# EAGLE design pixee (EAGLE 9.3.0)

## Sheet 1 of 2
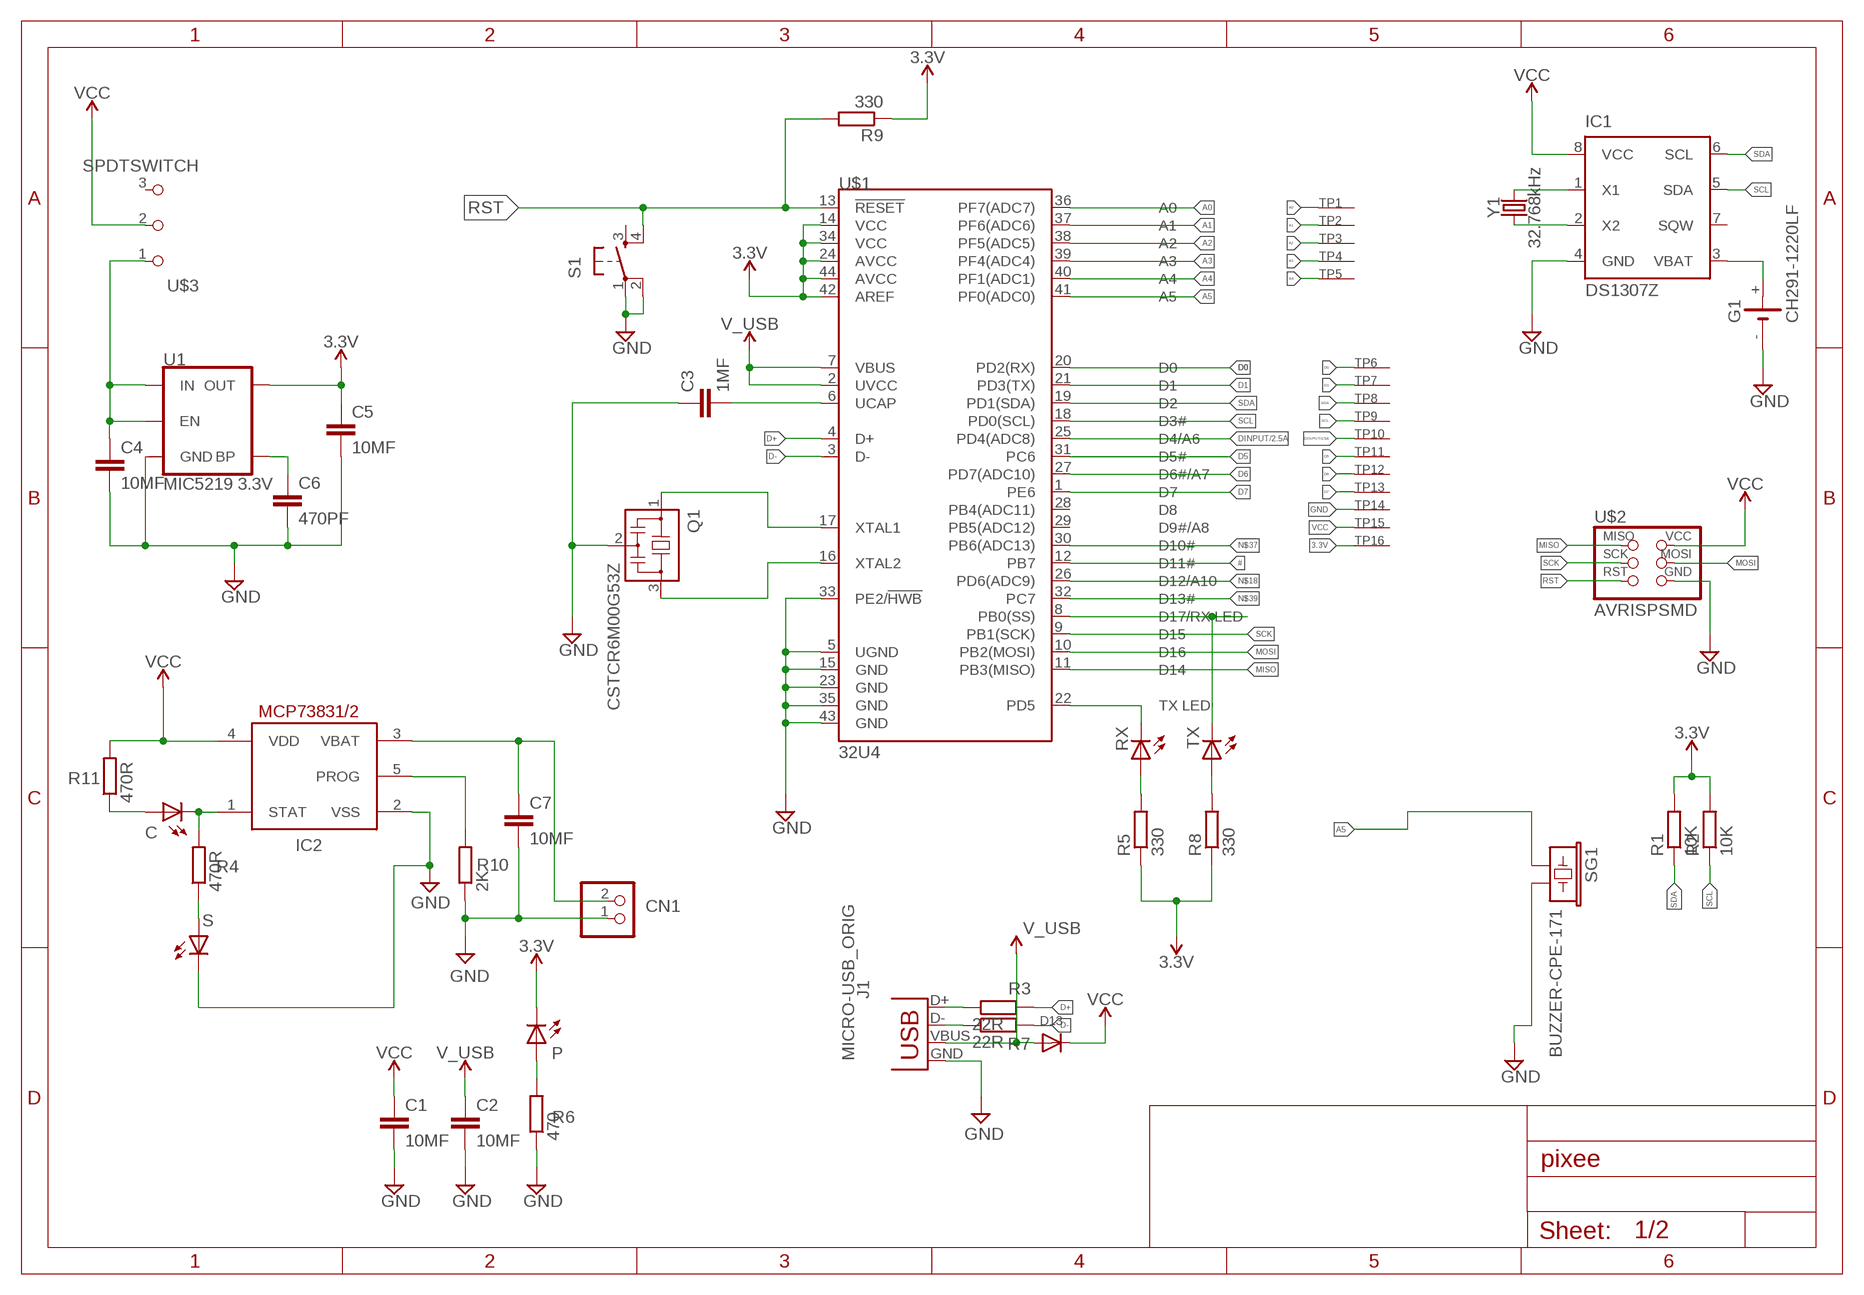
[diagram p0: schematic, sheet 1]

### Parts
C  LEDCHIP-LED0805  [CHIP-LED0805]
C1  10MF  C-EUC0603  [C0603]
C2  10MF  C-EUC0603  [C0603]
C3  1MF  C-EUC0603  [C0603]
C4  10MF  C-EUC0603  [C0603]
C5  10MF  C-EUC0603  [C0603]
C6  470PF  C-EUC0603  [C0603]
C7  10MF  C-EUC0603  [C0603]
CN1  JST_2PIN-SMT  [JST-PH-2-SMT]
D13  DIODESOD-123  [SOD-123]
G1  CH291-1220LF  [CH291-1220LF]
IC1  DS1307Z  [SOIC8]
IC2  MCP73831/OT  [SOT23-5L]
J1  MICRO-USB_ORIG  [DX4R005HJ5]
P  LEDCHIP-LED0805  [CHIP-LED0805]
Q1  CSTCR6M00G53Z  [CSTCR6M]
R1  10K  R-EU_M0805  [M0805]
R2  10K  R-EU_M0805  [M0805]
R3  22R  R-EU_M0805  [M0805]
R4  470R  R-EU_M0805  [M0805]
R5  330  R-EU_M0805  [M0805]
R6  470  R-EU_M0805  [M0805]
R7  22R  R-EU_M0805  [M0805]
R8  330  R-EU_M0805  [M0805]
R9  330  R-EU_M0805  [M0805]
R10  2K  R-EU_M0805  [M0805]
R11  470R  R-EU_M0805  [M0805]
RX  LEDCHIP-LED0805  [CHIP-LED0805]
S  LEDCHIP-LED0805  [CHIP-LED0805]
S1  6MM_SWITCH6MM_SWITCH  [6MM_SWITCH]
SG1  BUZZER-CPE-171  [BUZZER_9MM_PTH]
TP1  SEWTAP-2.0IN  [SEWINGTAP_2.0]
TP2  SEWTAP-2.0IN  [SEWINGTAP_2.0]
TP3  SEWTAP-2.0IN  [SEWINGTAP_2.0]
TP4  SEWTAP-2.0IN  [SEWINGTAP_2.0]
TP5  SEWTAP-2.0IN  [SEWINGTAP_2.0]
TP6  SEWTAP-2.0IN  [SEWINGTAP_2.0]
TP7  SEWTAP-2.0IN  [SEWINGTAP_2.0]
TP8  SEWTAP-2.0IN  [SEWINGTAP_2.0]
TP9  SEWTAP-2.0IN  [SEWINGTAP_2.0]
TP10  SEWTAP-2.0IN  [SEWINGTAP_2.0]
TP11  SEWTAP-2.0IN  [SEWINGTAP_2.0]
TP12  SEWTAP-2.0IN  [SEWINGTAP_2.0]
TP13  SEWTAP-2.0IN  [SEWINGTAP_2.0]
TP14  SEWTAP-2.0IN  [SEWINGTAP_2.0]
TP15  SEWTAP-2.0IN  [SEWINGTAP_2.0]
TP16  SEWTAP-2.0IN  [SEWINGTAP_2.0]
TX  LEDCHIP-LED0805  [CHIP-LED0805]
U1  MIC5219 3.3V  V_REG_MIC52193.3V  [SOT23-5]
U$1  32U4  ATMEGA32U4TQFP-44  [TQFP44]
U$2  AVRISPSMD  [2X03SMD]
U$3  SPDTSWITCH  [SPDTSWITCH]
Y1  32.768kHz  CRYSTAL-32.768KHZPTH-2X6  [CRYSTAL-PTH-2X6-CYL]

### Nets
3.3V: C5.1 P.C R1.2 R2.2 R5.1 R8.1 R9.1 TP16.P$1(SEW) U1.5(OUT) U$1.14(VCC) U$1.24(AVCC) U$1.34(VCC) U$1.42(AREF) U$1.44(AVCC)
#: U$1.12(PB7)
A0: TP1.P$1(SEW) U$1.36(PF7(ADC7))
A1: TP2.P$1(SEW) U$1.37(PF6(ADC6))
A2: TP3.P$1(SEW) U$1.38(PF5(ADC5))
A3: TP4.P$1(SEW) U$1.39(PF4(ADC4))
A4: TP5.P$1(SEW) U$1.40(PF1(ADC1))
A5: SG1.P$1 U$1.41(PF0(ADC0))
D0: TP6.P$1(SEW) U$1.20(PD2(RX))
D1: TP7.P$1(SEW) U$1.21(PD3(TX))
D5: TP11.P$1(SEW) U$1.31(PC6)
D6: TP12.P$1(SEW) U$1.27(PD7(ADC10))
D7: TP13.P$1(SEW) U$1.1(PE6)
D+: R3.2 U$1.4(D+)
D-: R7.2 U$1.3(D-)
DINPUT: TP10.P$1(SEW) U$1.25(PD4(ADC8)) ; also sheet 2
GND: C1.2 C2.2 C3.1 C4.2 C5.2 C6.2 C7.2 CN1.1 G1.- IC1.4(GND) IC2.2(VSS) J1.GND Q1.2 R6.1 R10.1 S1.1(P) S1.2(P1) S.C SG1.P$2 TP14.P$1(SEW) U1.2(GND) U$1.5(UGND) U$1.15(GND) U$1.23(GND) U$1.33(PE2/!HWB) U$1.35(GND) U$1.43(GND) U$2.6(GND) ; also sheet 2
MISO: U$1.11(PB3(MISO)) U$2.1(MISO)
MOSI: U$1.10(PB2(MOSI)) U$2.4(MOSI)
N$12: C3.2 U$1.6(UCAP)
N$13: Q1.1 U$1.17(XTAL1)
N$14: Q1.3 U$1.16(XTAL2)
N$15: IC1.1(X1) Y1.2
N$16: IC1.2(X2) Y1.1
N$17: G1.+ IC1.3(VBAT)
N$18: U$1.26(PD6(ADC9))
N$19: C.C IC2.1(STAT) R4.2
N$20: IC2.5(PROG) R10.2
N$21: P.A R6.2
N$22: C.A R11.1
N$23: R4.1 S.A
N$24: C7.1 CN1.2 IC2.3(VBAT)
N$25: J1.D+ R3.1
N$26: C6.1 U1.4(BP)
N$27: J1.D- R7.1
N$28: C4.1 U1.1(IN) U1.3(EN) U$3.1
N$29: RX.C U$1.22(PD5)
N$30: R5.2 RX.A
N$32: R8.2 TX.A
N$37: U$1.30(PB6(ADC13))
N$39: U$1.32(PC7)
N$40: TX.C U$1.8(PB0(SS))
RST: R9.2 S1.4(S1) U$1.13(!RESET) U$2.5(RST)
SCK: U$1.9(PB1(SCK)) U$2.3(SCK)
SCL: IC1.5(SDA) R2.1 TP9.P$1(SEW) U$1.18(PD0(SCL))
SDA: IC1.6(SCL) R1.1 TP8.P$1(SEW) U$1.19(PD1(SDA))
V_USB: C2.1 D13.A J1.VBUS U$1.2(UVCC) U$1.7(VBUS)
VCC: C1.1 D13.C IC1.8(VCC) IC2.4(VDD) R11.2 TP15.P$1(SEW) U$2.2(VCC) U$3.2 ; also sheet 2
Unconnected: IC1.7(SQW) S1.3(S) U$1.28(PB4(ADC11)) U$1.29(PB5(ADC12)) U$3.3

## Sheet 2 of 2
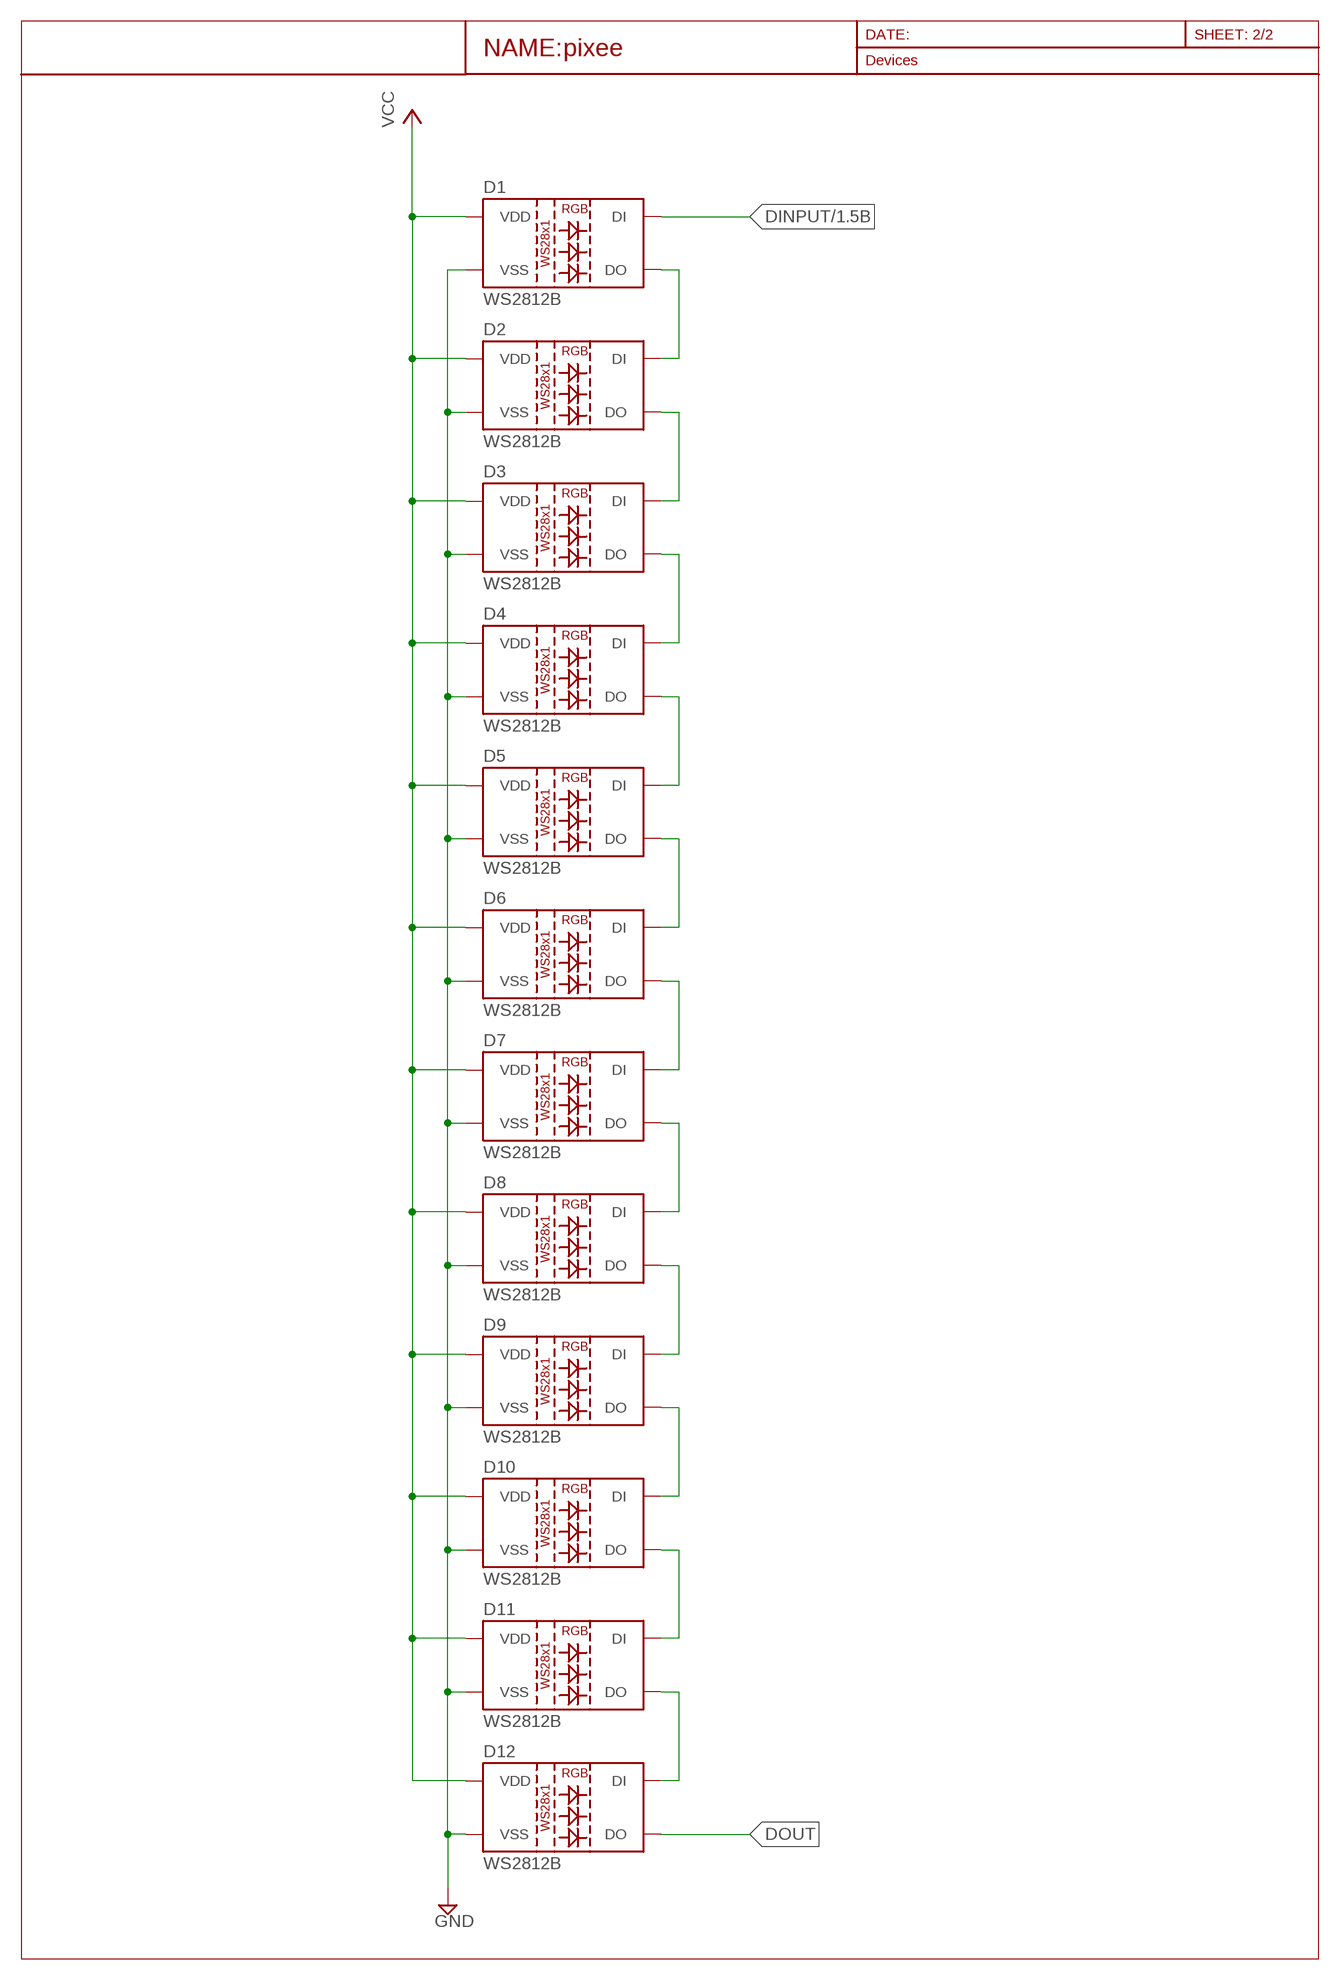
[diagram p1: schematic, sheet 2]

### Parts
D1  WS2812B  [WS2812B]
D2  WS2812B  [WS2812B]
D3  WS2812B  [WS2812B]
D4  WS2812B  [WS2812B]
D5  WS2812B  [WS2812B]
D6  WS2812B  [WS2812B]
D7  WS2812B  [WS2812B]
D8  WS2812B  [WS2812B]
D9  WS2812B  [WS2812B]
D10  WS2812B  [WS2812B]
D11  WS2812B  [WS2812B]
D12  WS2812B  [WS2812B]

### Nets
DINPUT: D1.4(DI) ; also sheet 1
DOUT: D12.2(DO)
GND: D1.3(VSS) D2.3(VSS) D3.3(VSS) D4.3(VSS) D5.3(VSS) D6.3(VSS) D7.3(VSS) D8.3(VSS) D9.3(VSS) D10.3(VSS) D11.3(VSS) D12.3(VSS) ; also sheet 1
N$1: D1.2(DO) D2.4(DI)
N$2: D2.2(DO) D3.4(DI)
N$3: D3.2(DO) D4.4(DI)
N$4: D4.2(DO) D5.4(DI)
N$5: D5.2(DO) D6.4(DI)
N$6: D6.2(DO) D7.4(DI)
N$7: D7.2(DO) D8.4(DI)
N$8: D8.2(DO) D9.4(DI)
N$9: D9.2(DO) D10.4(DI)
N$10: D10.2(DO) D11.4(DI)
N$11: D11.2(DO) D12.4(DI)
VCC: D1.1(VDD) D2.1(VDD) D3.1(VDD) D4.1(VDD) D5.1(VDD) D6.1(VDD) D7.1(VDD) D8.1(VDD) D9.1(VDD) D10.1(VDD) D11.1(VDD) D12.1(VDD) ; also sheet 1

## Library data of the parts
C P RX S TX = adafruit:LED: LED OSRAM: - CHIPLED LG R971, LG N971, LY N971, LG Q971, LY Q971, LO R971, LY R971 LH N974, LH R974 LS Q976, LO Q976, LY Q976 LO Q996 - Hyper CHIPLED LW Q18S LB Q993, LB Q99A, LB R99A - SideLED LS A670, LO A670, LY A670, LG A670, LP A670 LB A673, LV A673, LT A673, LW A673 LH A674 LY A675 LS A676, LA A676, LO A676, LY A676, LW A676 LS A679, LY A679, LG A679 - Hyper Micro SIDELED® LS Y876, LA Y876, LO Y876, LY Y876 LT Y87S - SmartLED LW L88C, LW L88S LB L89C, LB L89S, LG L890 LS L89K, LO L89K, LY L89K LS L896, LA L896, LO L896, LY L896 - TOPLED LS T670, LO T670, LY T670, LG T670, LP T670 LSG T670, LSP T670, LSY T670, LOP T670, LYG T670 LG T671, LOG T671, LSG T671 LB T673, LV T673, LT T673, LW T673 LH T674 LS T676, LA T676, LO T676, LY T676, LB T676, LH T676, LSB T676, LW T676 LB T67C, LV T67C, LT T67C, LS T67K, LO T67K, LY T67K, LW E67C LS E67B, LA E67B, LO E67B, LY E67B, LB E67C, LV E67C, LT E67C LW T67C LS T679, LY T679, LG T679 LS T770, LO T770, LY T770, LG T770, LP T770 LB T773, LV T773, LT T773, LW T773 LH T774 LS E675, LA E675, LY E675, LS T675 LS T776, LA T776, LO T776, LY T776, LB T776 LHGB T686 LT T68C, LB T68C - Hyper Mini TOPLED® LB M676 - Mini TOPLED Santana® LG M470 LS M47K, LO M47K, LY M47K Source: http://www.osram.convergy.de/
C1-C7 = rcl:C-EU: CAPACITOR, European symbol; SPICEPREFIX: C
CN1 = adafruit:JST_2PIN: JST 2-Pin Connectors of various flavors SMT-RA (S2B-PH-SM4) 4UConnector #17311 SMT (B2B-PH-SM4) THM-RA (S2B-PH) THM (B2B-PH)
D1-D12 = SparkFun-LED:WS2812B: WS2812B SMD addressable RGB LED 5x5mm SMD LED with built-in controller IC. Color: Red/Green/Blue mC Rating: RGB: 390, 660, 180 mcd Forward Voltage: RGB: 2.0, 3.0, 3.0 V Packages:WS2812B SparkFun Products: Blynk Board - ESP8266 <https://www.sparkfun.com/products/13794>; PROD_ID: DIO-12503
D13 = adafruit:DIODE: Diode SMADIODE - SMA Surface Mount Package 20V 1A Schottky Diode Digikey: 641-1014-6-ND DO-1N4148 - Through Hole Small Current Diode SOD-123 20V 1 A (.5mV Vf) Schottky Diode - Digikey: MBRX120TPMSCT-ND SOD-323 10V 570mA (.38mV Vf, 3ns) Schottky Diode - Digikey: ZLLS410CT-ND SOD-523 30V 30mA Schottky Diode (RB751S-40TE61) - Digikey: RB751S-40TE61CT-ND SOT23-R/W - SOT23 Package (R = Solder Paste/Reflow Ovens, W = Hand-Soldering) BAT54Film 40V 300mA - Digikey: 497-7162-1-ND
G1 = battery:CH291-1220LF: Battery Holder, SMT, 12mm multicomp PART NO. CH291-1220LF Source: Data sheet <http://www.farnell.com/datasheets/1505860.pdf>
IC1 = ds1307_pcf8583:DS1307: I2C-Bus CLOCK/CALENDAR
IC2 = adafruit:MCP73831: MCP73831/2 Miniature Single-Cell, Fully Integrated Li-Ion, Li-Polymer Charge Management Controllers. Nice and small simple lipoly charge controller, with adjustable current and status output (LED) http://www.ladyada.net/library/pcb/eaglelibrary.html
J1 = fab:MICRO-USB: SMD micro USB connector as found in the fablab inventory. Three footprint variants included: original, as described by manufacturer's datasheet for milling with the 1/100" bit for milling with the 1/64" bit Made by Zaerc.
Q1 = murata-filter:CSTCR: Resonator Source: murata.co.jp; MPN: CSTCR6M00G53-R0; OC_FARNELL: 1170434; OC_NEWARK: 25M8759
R1-R11 = rcl:R-EU_: RESISTOR, European symbol; SPICEPREFIX: R
S1 = fab:6MM_SWITCH: OMRON SWITCH
SG1 = bt_buzzer:BUZZER: Buzzer 12mm Spark Fun Electronics SKU : Comp-Buzzer
TP1-TP16 = adafruit:SEWTAP
U1 = SparkFun-IC-Power:V_REG_MIC5219: V_REG MIC5219 Standard 3.3V and 5V 500mA LDO voltage regulator in SOT-23 layout. Micrel part MIC5219. BP (by-pass) pin is used to lower output noise with 470pF cap, may be left open.; PROD_ID: VREG-09872
U$1 = SparkFun-IC-Microcontroller:ATMEGA32U4: Atmel MCU, 32KByte Atmel 44-pin 8-bit Microcontroller with 32KBytes of ISP Flash and USB Controller Datasheet <http://cdn.sparkfun.com/datasheets/Dev/Arduino/Boards/ATMega32U4.pdf> SparkFun Products LilyPad Arduino USB - ATmega32U4 Board <https://www.sparkfun.com/products/12049> (DEV-12049) Pro Micro - 5V/16MHz <https://www.sparkfun.com/products/12640> (DEV-12640) Pro Micro - 3.3V/8MHz <https://www.sparkfun.com/products/12587> (DEV-12587) Fio v3 - ATmega32U4 <https://www.sparkfun.com/products/11520> (DEV-11520) Qduino Mini <https://www.sparkfun.com/products/13614> (DEV-13614) Makey Makey - Standard Kit <https://www.sparkfun.com/products/11511> (WIG-11511) Makey Makey Deluxe Kit <https://www.sparkfun.com/products/11519> (WIG-11519); PROD_ID: IC-11161
U$2 = fab:AVRISP
U$3 = fab:SPDTSWITCH
Y1 = SparkFun-Clocks:CRYSTAL-32.768KHZ: 32.768kHz Crystal Frequency: 32.768kHz Frequency Stability: ±20ppm Load Capacitance: 12.5pF (PTH-2X6 & SMD-3.2X1.5), 6pF (SMD-2X6) SparkFun Products: SparkFun BigTime Watch Kit <https://www.sparkfun.com/products/11734> SparkFun nRF52832 Breakout <https://www.sparkfun.com/products/13990> SparkFun Real Time Clock Module <https://www.sparkfun.com/products/12708>; PROD_ID: XTAL-10112

## Board
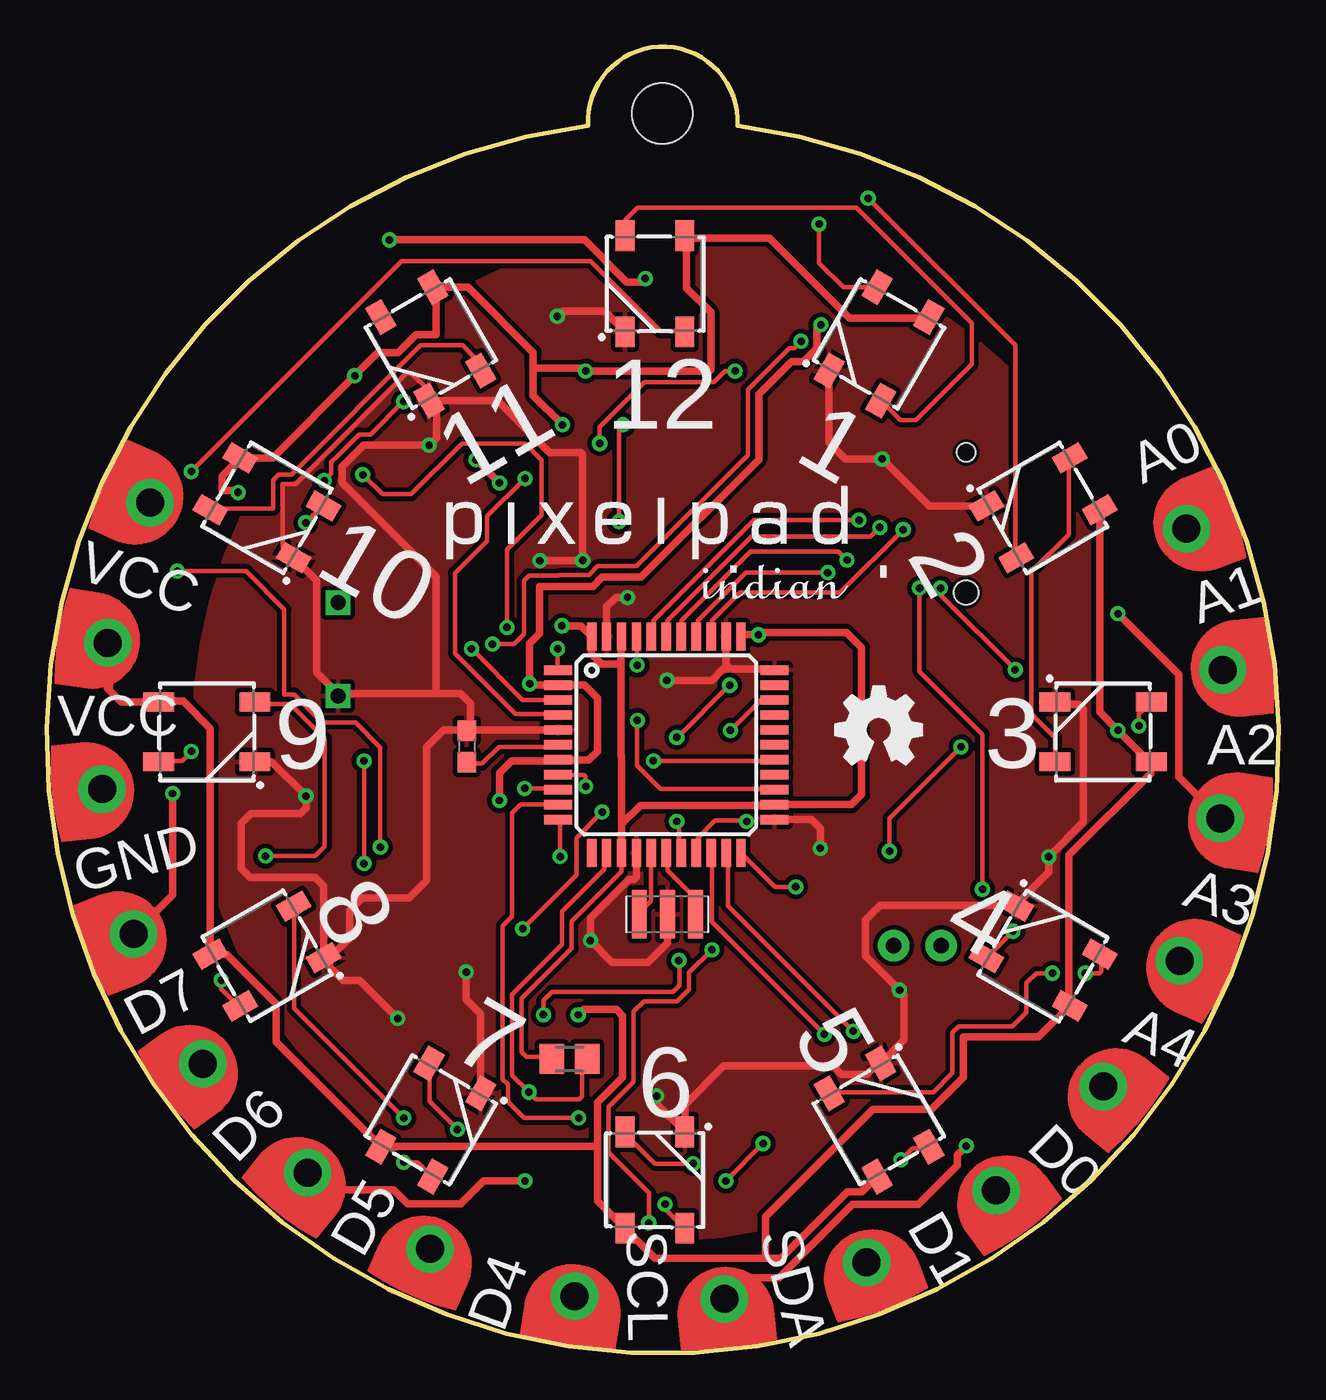
[diagram p2: board, top side]
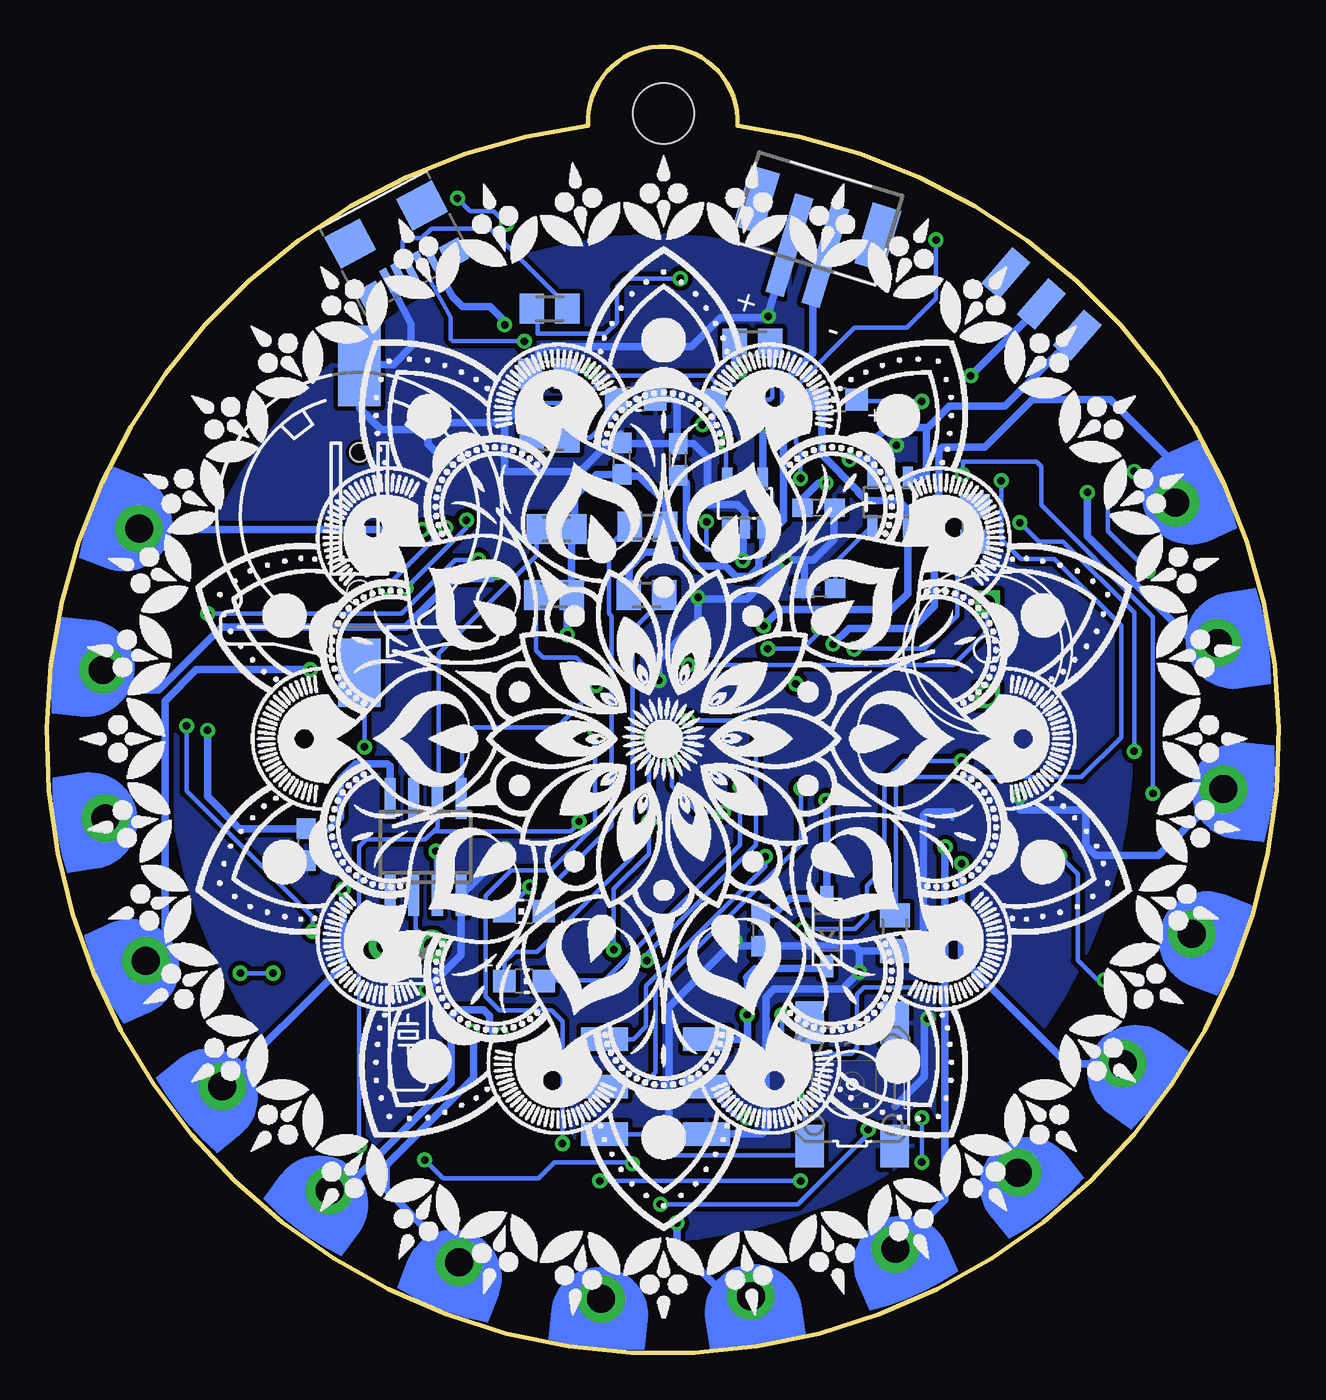
[diagram p3: board, bottom side, seen from below]

Size 65.99 x 69.95 mm. Coordinates in mm from the lower left corner, seen from the top.
Outline: 29,65.71 arc346 36.99,65.71 arc187 29,65.71
Copper layers (1*16): Top 0.035mm / dielectric 1.5mm / Bottom 0.035mm
Design rules "default *": minimum track width 10mil, minimum drill 0.4mm, track to track 10mil, track to pad 10mil, pad to pad 10mil, via to via 10mil, smd to smd 10mil, copper to edge 8mil, drill to drill 8mil, minimum pad ring 10mil, minimum via ring 8mil, stop-mask expansion 4mil, vias tented up to drill 0mil, thermal gap 10mil
Holes 3.25 mm at 32.96,66.36

### Footprints (pad centres in the part's own frame; a part is rotated, then mirrored left to right if it is on the bottom)
CHIP-LED0805 = smd 1.2 x 1.2: A 0,-1.05; C 0,1.05
C0603 = smd 1.1 x 1: 1 -0.85,0; 2 0.85,0
JST-PH-2-SMT = smd 1 x 5.5: 1 -1,-1.8; 2 1,-1.8 | smd 1.6 x 3.4: NC1 -3.4,0; NC2 3.4,0
WS2812B = smd 1.651 x 1: 1 2.577,-1.6; 2 2.577,1.6; 3 -2.577,1.6; 4 -2.577,-1.6
SOD-123 = smd 1.2 x 0.7: A 1.85,0; C -1.85,0
CH291-1220LF = smd 2.3 x 3.66: + 0,-2.296 | smd 2.3 x 4.3: - 0,14.146 | hole 1.3: 0,2 | hole 1: 0,9.5
SOIC8 = smd 0.6 x 2.2: 1 -1.905,-2.6; 2 -0.635,-2.6; 3 0.635,-2.6; 4 1.905,-2.6; 5 1.905,2.6; 6 0.635,2.6; 7 -0.635,2.6; 8 -1.905,2.6
SOT23-5L = smd 0.55 x 1.2: 1 -0.95,-1.3; 2 0,-1.3; 3 0.95,-1.3; 4 0.95,1.3; 5 -0.95,1.3
DX4R005HJ5 = smd 0.4 x 1.35: D+ 0,1.6; D- -0.65,1.6; GND 1.3,1.6; ID 0.65,1.6; VBUS -1.3,1.6 | smd 1.2 x 1.3: GND@1 -2.5,1.95; GND@2 2.5,1.95 | smd 2.15 x 1.9: GND@3 -2.175,-1.1; GND@4 2.175,-1.1
CSTCR6M = smd 0.8 x 2.6: 1 -1.5,0; 2 0,0; 3 1.5,0
M0805 = smd 1.3 x 1.6: 1 -0.95,0; 2 0.95,0
6MM_SWITCH = smd 2.286 x 1.524: 1 -3.302,2.286; 2 3.302,2.286; 3 -3.302,-2.286; 4 3.302,-2.286
BUZZER_9MM_PTH = drill 0.8 square: P$1 0,2.5; P$2 0,-2.5
SEWINGTAP_2.0 = drill 1.5 pad 2.54: P$1 0,0
SOT23-5 = smd 0.55 x 1.2: 1 -0.95,-1.3; 2 0,-1.3; 3 0.95,-1.3; 4 0.95,1.3; 5 -0.95,1.3
TQFP44 = smd 1.5 x 0.5: 1 -5.8,4; 2 -5.8,3.2; 3 -5.8,2.4; 4 -5.8,1.6; 5 -5.8,0.8; 6 -5.8,0; 7 -5.8,-0.8; 8 -5.8,-1.6; 9 -5.8,-2.4; 10 -5.8,-3.2; 11 -5.8,-4; 23 5.8,-4; 24 5.8,-3.2; 25 5.8,-2.4; 26 5.8,-1.6; 27 5.8,-0.8; 28 5.8,0; 29 5.8,0.8; 30 5.8,1.6; 31 5.8,2.4; 32 5.8,3.2; 33 5.8,4 | smd 0.5 x 1.5: 12 -4,-5.8; 13 -3.2,-5.8; 14 -2.4,-5.8; 15 -1.6,-5.8; 16 -0.8,-5.8; 17 0,-5.8; 18 0.8,-5.8; 19 1.6,-5.8; 20 2.4,-5.8; 21 3.2,-5.8; 22 4,-5.8; 34 4,5.8; 35 3.2,5.8; 36 2.4,5.8; 37 1.6,5.8; 38 0.8,5.8; 39 0,5.8; 40 -0.8,5.8; 41 -1.6,5.8; 42 -2.4,5.8; 43 -3.2,5.8; 44 -4,5.8
2X03SMD = smd 2.54 x 1.27: 1 -2.54,2.54; 2 2.92,2.54; 3 -2.54,0; 4 2.92,0; 5 -2.54,-2.54; 6 2.92,-2.54
SPDTSWITCH = smd 2.54 x 1.27: 1 0.38,2.54; 2 0.38,0; 3 0.38,-2.54
CRYSTAL-PTH-2X6-CYL = drill 0.813 pad 1.676: 1 -1.27,0; 2 1.27,0

### Placement (x,y rotation side)
C  29.16,51.05 90 bottom
C1  52.09,27.21 270 bottom
C2  27.75,22.64 270 bottom
C3  22.5,32.47 270 top
C4  24.65,45.26 0 bottom
C5  35.18,47.89 90 bottom
C6  24.6,40.93 180 bottom
C7  32.17,47.84 90 bottom
CN1  24.72,60.75 343 bottom
D1  32.58,57.25 90 top
D2  44.58,54.04 60 top
D3  53.36,45.25 30 top
D4  56.58,33.25 0 top
D5  53.36,21.25 330 top
D6  44.58,12.47 300 top
D7  32.58,9.25 270 top
D8  20.58,12.47 240 top
D9  11.79,21.25 210 top
D10  8.58,33.25 180 top
D11  11.79,45.25 150 top
D12  20.58,54.04 120 top
D13  24.19,22.54 90 bottom
G1  49.24,38.72 0 bottom
IC1  45.7,27.09 0 bottom
IC2  28.59,45.5 0 bottom
J1  47.29,59.45 208 bottom
P  23.67,51.05 90 bottom
Q1  33.24,23.49 180 top
R1  38.68,44.11 0 bottom
R2  38.82,40.57 0 bottom
R3  39.06,55.92 180 bottom
R4  39.06,49.01 180 bottom
R5  33.81,44.24 180 bottom
R6  20.57,22.47 90 bottom
R7  16.26,44.4 270 bottom
R8  33.87,40.57 0 bottom
R9  28,15.73 0 top
R10  39.15,52.44 0 bottom
R11  28.19,54.06 180 bottom
RX  40.42,23.64 90 bottom
S  34.45,51.07 270 bottom
S1  22.85,14.37 270 bottom
SG1  15.6,37.68 0 bottom
TP1  61.04,44.13 291 top
TP2  62.99,36.58 276 top
TP3  62.84,28.63 261 top
TP4  60.68,21 246 top
TP5  56.59,14.26 231 top
TP6  50.85,8.7 216 top
TP7  43.9,4.84 201 top
TP8  36.29,2.89 186 top
TP9  28.28,3.04 171 top
TP10  20.54,5.56 156 top
TP11  13.98,9.65 141 top
TP12  8.36,15.48 126 top
TP13  4.66,22.43 111 top
TP14  2.97,30.19 96 top
TP15  3.28,38.02 81 top
TP16  5.53,45.53 66 top
TX  40.42,19.91 270 bottom
U1  20.82,45.56 180 bottom
U$1  33.19,32.56 0 top
U$2  33.57,14.26 0 bottom
U$3  12.46,56.46 229 bottom
Y1  46.63,21.8 180 bottom

### Tracks (layer width: path | path; a pad name or v marks a point on that pad's centre or on a via)
3.3V  (via drill 0.4)
  Top 0.254: 30.75,26.83 U$1.14 30.79,25.79 28.12,23.12 28.12,21.66 25.44,18.98 25.44,16.12 25.7,15.85 26.93,15.85 R9.1 | 30.75,38.33 U$1.42 30.75,38.46 | 29.25,38.46 U$1.44 | 38.87,29.33 U$1.24 | U$1.34 37.25,38.46 | 5.62,45.46 TP16.P$1 5.75,45.21
  Top 0.406: 39.03,29.31 37.85,29.31 37.85,29.32 31.79,29.32 30.79,28.31 | 39.5,29.31 39.03,29.31 | 39.03,29.31 U$1.24 43.1,29.36 43.64,29.89 43.64,37.77 42.83,38.58 38.24,38.58 v38.12,38.46 37.25,38.46 | U$1.14 30.79,28.31 | 30.79,28.31 30.79,31.95 30.76,31.98 30.76,36.75 | 30.75,38.33 30.76,38.32 30.76,36.75 | 30.76,36.75 30.63,36.88 29.72,36.88 29.19,37.42 U$1.44 | U$1.44 | U$1.44 28.61,38.94 v27.6,38.94
  Bottom 0.254: 20,44.33 U1.5 | P.C | 38.12,40.33 38,40.46 R2.2 37.75,40.58 | 37.75,44.08 R1.2 37.62,44.21 | 32.75,44.33 R5.1 32.62,44.21 | 34.75,40.58 R8.1 | 35.12,46.71 35.12,46.96 C5.1 35.12,46.71
  Bottom 0.406: P.C 24.48,50.82 24.48,48.1 22.5,46.12 22.5,46.07 22.07,45.64 20.37,45.64 19.94,45.21 19.88,45.21 | 19.88,45.21 U1.5 19.87,40.68 20.74,39.81 26.73,39.81 v27.6,38.94 | R8.1 34.82,42.03 33.96,42.89 32.92,42.89 32.92,44.03 32.86,44.08 R5.1 32.86,45.56 34.26,46.96 35.12,46.96 | C5.1 36.54,47.04 37.73,45.85 37.73,44.51 | 37.73,44.51 R1.2 | R2.2 37.87,44.38 37.73,44.51 | 38.12,40.33 v38.12,38.46 | TP16.P$1 5.53,47.56 9.02,51.04 13.2,51.04 15.74,48.5 18.03,48.5 18.21,48.32 18.21,45.86 18.87,45.21 19.88,45.21
A0  (via drill 0.4)
  Top 0.254: v45.87,44.08 42.5,40.71 37.12,40.71 35.62,39.21 35.62,38.46 U$1.36
  Bottom 0.254: 61,44.08 TP1.P$1
  Bottom 0.406: v45.87,44.08 61.57,44.08 61.62,44.13 | 61.68,44.2 61.62,44.13 | 61.62,44.13 TP1.P$1
A1  (via drill 0.4)
  Top 0.254: v41.83,41.78 37.44,41.78 34.87,39.21 34.87,38.46 U$1.37
  Bottom 0.254: 62.87,36.58 62.97,36.58 TP2.P$1 62.05,37.51
  Bottom 0.406: 62.97,36.58 61.9,35.5 60,35.5 56.63,38.87 46.77,38.87 44.16,41.47 42.14,41.47 v41.83,41.78
A2  (via drill 0.4)
  Top 0.254: U$1.38 34,38.46 34,39.21 37.71,42.92 42.41,42.92 v42.87,42.46 | 62.75,28.71 TP3.P$1
  Top 0.406: TP3.P$1 60.63,30.84 60.63,36.32 v57.37,39.58
  Bottom 0.254: v42.87,42.46 44.12,42.46 47,39.58 v57.37,39.58
A3  (via drill 0.4)
  Top 0.254: v44.62,44.21 44.12,43.71 37.75,43.71 33.25,39.21 33.25,38.46 U$1.39 | v47.87,40.96 47.87,40.58 v51.87,36.58
  Bottom 0.254: v47.87,40.96 v44.62,44.21 | TP4.P$1 60.62,21.08 60.3,21.08
  Bottom 0.406: TP4.P$1 59.66,22.02 59.66,34.91 57.99,36.58 v51.87,36.58
A4  (via drill 0.4)
  Top 0.254: v43.51,44.59 37.88,44.59 32.5,39.21 32.5,38.46 U$1.40 | v46.75,40.96 46.75,36.5 50.12,33.12 v50.12,24.83
  Bottom 0.254: 56.5,14.33 TP5.P$1 | v46.75,40.96 43.51,44.19 v43.51,44.59
  Bottom 0.406: v50.12,24.83 50.12,20.73 TP5.P$1
A5  (via drill 0.4)
  Top 0.254: v31.62,36.83 31.62,38.33 U$1.41
  Bottom 0.254: v31.62,36.83 17.42,36.83 15.6,38.65 SG1.P$1
D0  (via drill 0.4)
  Top 0.254: v41.64,17.06 35.62,23.09 35.62,26.71 U$1.20
  Bottom 0.254: 50.5,8.71 50.75,8.71 TP6.P$1
  Bottom 0.406: TP6.P$1 50.09,8.69 44.33,14.45 44.33,18.02 43.99,18.36 42.58,18.36 42.28,18.06 42.28,17.37 41.97,17.06 v41.64,17.06
D1  (via drill 0.4)
  Top 0.254: v43.2,17.22 36.5,23.92 36.5,26.71 U$1.21
  Bottom 0.254: TP7.P$1 44,4.96
  Bottom 0.406: TP7.P$1 47.82,8.75 47.82,10.03 43.13,14.72 43.13,17.16 v43.2,17.22
D5  (via drill 0.4)
  Top 0.254: v36.62,33.33 38.25,34.96 38.87,34.96 U$1.31 | v36.37,9.21 v38.37,11.21 | TP11.P$1 14,9.58
  Top 0.406: TP11.P$1 14.89,8.74 18.57,8.74 19.32,7.98 22.17,7.98 23.39,9.21 v25.62,9.21
  Bottom 0.254: v36.62,33.33 36.62,28.21 39,25.83 41.12,25.83 42.5,24.46 42.5,19.1 41.73,18.34 38.96,18.34 38.37,17.75 v38.37,11.21 | v25.62,9.21 v36.37,9.21
D6  (via drill 0.4)
  Top 0.254: v32.5,31.71 38.87,31.71 U$1.27 | v29.75,28.96 28.37,27.58 28.37,25.58 v25.5,22.71 | v17,26.21 v17,31.71
  Bottom 0.254: 8.37,15.58 TP12.P$1 | v17,31.71 20.07,31.71 21.12,30.66 21.12,25.96 22.07,25.01 22.07,23.35 22.71,22.71 v25.5,22.71 | v29.75,28.96 31.1,28.96 32.5,30.35 v32.5,31.71
  Bottom 0.406: v17,26.21 17,21.15 11.33,15.48 TP12.P$1
D7  (via drill 0.4)
  Top 0.254: v27.37,37.71 27.37,36.58 U$1.1 | v16.93,47.03 17.98,45.98 19.52,45.98 22.25,48.71 25.62,48.71 26.51,47.82 26.51,44.88 24.65,43.02 v24.65,38.85 | 4.75,22.46 TP13.P$1
  Top 0.406: TP13.P$1 6.75,24.52 v6.75,29.96
  Bottom 0.254: v6.75,29.96 6.75,39.42 12.72,45.39 12.72,47.47 12.98,47.73 16.93,47.73 v16.93,47.03 | v27.37,37.71 25.49,37.71 24.65,38.55 v24.65,38.85
D+  (via drill 0.4)
  Top 0.254: U$1.4 27.37,34.21 25.12,34.21 21.87,37.46 21.87,41.77 23.59,43.49 23.59,44.8 v25.62,46.83
  Top 0.406: v18.37,59.6 28.8,59.6 31.07,57.34 31.86,57.34 v32.06,57.54
  Bottom 0.254: 40.12,55.83 R3.2 39.7,55.61 39.7,54.58 36.05,54.58 35.45,55.18 35.45,57.1 35.02,57.54 v32.06,57.54 | v25.62,46.83 25.62,48.49 25.86,48.73 25.86,51.76 22.72,54.9 19.92,54.9 18.37,56.45 v18.37,59.6
D-  (via drill 0.4)
  Top 0.254: v22.75,37.71 25.5,34.96 27.37,34.96 U$1.3
  Bottom 0.254: v22.75,37.71 18.98,37.71 17.21,39.48 17.21,41.88 17,42.09 16.51,42.09 16.37,42.23 16.37,43.33 R7.2 16.26,42.82
DINPUT  (via drill 0.4)
  Top 0.254: U$1.25 38.87,30.21 32.87,30.21 31.62,31.46 31.62,33.85 v31.64,33.87 | v7.75,47.21 19,58.46 29.12,58.46 32.87,54.71 34.12,54.71 D1.4 | v7,41.86 10.67,41.86 12.72,39.81 12.72,35.26 13.25,35.26 14.76,33.75 16.55,33.75 17.87,32.43 v17.87,27.08 | v33.86,21.01 33.89,20.98 33.89,19.69 33.54,19.33 27.07,19.33 26.6,18.87 v26.6,18.11
  Bottom 0.254: v33.86,21.01 33.86,21.34 28,27.21 28,33.48 28.39,33.87 v31.64,33.87 | TP10.P$1 20.5,5.58 | 17.89,16.56 17.87,16.58 | v7,41.86 9.15,44.01 9.15,46.49 8.44,47.21 v7.75,47.21 | 17.89,19.56 22.23,19.56 22.59,19.21 22.59,16.3 22.88,16.01 25.92,16.01 26.6,16.7 v26.6,18.11
  Bottom 0.406: TP10.P$1 17.89,8.2 17.89,16.56 17.89,19.56 17.89,27.06 v17.87,27.08
GND  (via drill 0.4)
  Top 0.254: 33.12,22.58 33.12,23.46 Q1.2 | 31.5,26.71 U$1.15 | 23.25,14.71 23.25,13.96 D8.3 | D9.3 14.87,21.08 | 22.53,33.36 C3.1 22.4,33.36 | 27.37,33.33 U$1.5 27.5,33.46 | 29.87,38.33 U$1.43 | 20.87,50.58 20.5,50.96 D12.3 20.48,51.52 19.53,52.48 19.27,52.48 13.33,46.53 12.64,46.53 12.64,43.17 D11.3 | 11.12,31.71 D10.3 | 13.12,42.58 D11.3 | 13.25,42.71 D11.3 | 30.87,54.71 D1.3 | 50.25,45.46 D3.3 | 42,52.58 D2.3 | 34.25,11.83 D7.3 34.12,11.83 | 44.62,15.46 D6.3 | 52,23.96 D5.3 51.87,23.96 | 54.12,34.83 D4.3 | 39,28.58 U$1.23 | 39,36.46 U$1.33 | 36.5,38.33 U$1.35 | 38.87,36.58 U$1.33 | 39.5,36.58 U$1.33
  Top 0.406: U$1.35 36.39,36.85 36.63,36.61 | 36.63,36.61 38.93,36.61 U$1.33 | 15.15,21.16 D9.3 14.82,25 14.37,25.46 10.9,25.46 10.42,25.94 10.42,28.36 10.94,28.89 13.59,28.89 13.88,29.18 v13.88,29.81 12.04,31.65 D10.3 | 15.15,21.16 15.16,21.16 16.22,22.22 16.22,23.7 16.88,24.37 19.42,24.37 20.35,25.3 20.35,32.45 21.26,33.36 22.4,33.36 | 15.15,21.16 15.15,20.67 15.88,19.94 16.77,19.94 v18.8,17.9 | 20.87,50.58 20.87,48.99 v20.48,48.6 16.99,48.6 15.83,47.45 15.83,46.61 20.86,41.58 20.86,35.3 | D1.3 29.87,55.79 27.62,55.79 v27.35,55.52 | D4.3 54.14,34.71 55.28,34.71 55.51,34.48 55.51,28.42 v53.66,26.57 53.66,25.75 51.87,23.96 44.62,23.96 43.85,23.19 43.85,21.25 v45.68,19.42 45.92,19.18 45.92,16.75 D6.3 44.53,15.5 43.94,14.91 42.57,14.91 42.13,15.36 36.25,15.36 34.18,13.29 D7.3 32.67,13.34 v32.67,13.75 | v41.44,27.02 41.44,28.07 40.95,28.56 U$1.23 | Q1.2 33.24,21.95 32.21,20.92 30.28,20.92 v29.12,22.08 29.12,23.3 31.18,25.36 31.46,25.36 31.59,25.49 U$1.15 | 27.37,33.33 27.34,33.36 22.53,33.36 22.69,33.52 22.69,34.78 22.17,35.3 20.86,35.3 | D8.3 23.25,18.15 22.47,18.93 v22.47,20.39 | D11.3 14.45,41.36 14.45,36.43 15.58,35.3 20.86,35.3 | D3.3 47.27,45.35 v44.75,47.87 42.78,47.87 41.9,48.75 D2.3 | 36.63,36.61 36.22,36.61 35.63,36.02 v33.21,36.02 | 28.69,42.42 v26.42,42.42 | 28.69,42.42 v28.71,42.44 | v31.11,40.46 30.48,40.46 29.99,39.96 U$1.43 | D12.3 24.15,51.01 26.93,48.22 28.62,48.22 28.69,48.14 28.69,42.42
  Bottom 0.254: 4,29.08 3.07,30.01 3,30.08 TP14.P$1 | 30.62,11.71 U$2.6 30.75,11.83 | 20.75,21.71 20.62,21.58 R6.1 20.5,21.46 | 27.75,21.71 C2.2 | 28.12,22.08 27.87,21.83 C2.2 | 27.75,21.58 C2.2 | 17.5,28.58 17.5,28.96 | 20.87,46.96 U1.2 | 26.25,59.33 CN1.1 | 23.87,45.21 C4.2 | 25.37,40.96 C6.2 | 32.25,48.71 C7.2 | 35.12,48.71 C5.2 35.25,48.71 | 33.5,50.96 S.C | 47.62,57.33 J1.GND | 49.12,52.96 49.17,52.92 G1.- | 40.12,52.46 R10.1 40.12,52.58 | 52.12,26.33 C1.2 | 43.75,24.58 IC1.4
  Bottom 0.406: 35.25,49.22 35.25,48.71 35.93,48.71 37.44,47.2 41.47,47.2 41.47,49.81 | 35.13,48.69 C5.2 35.15,48.71 32.25,48.71 32.25,50.81 32.22,50.84 32.45,51.07 S.C | R6.1 20.5,21.6 | 10.34,29.02 10.34,27.17 9.79,26.63 6.45,26.63 3.07,30.01 | 10.5,29.08 13.88,29.08 v13.88,29.81 | R6.1 22.46,21.52 | 27.6,21.43 27.75,21.58 | R6.1 19.43,21.52 19.41,21.5 19.04,21.88 19.04,28.77 18.85,28.96 17.5,28.96 | U1.2 20.82,48.26 v20.48,48.6 | C4.2 23.84,45.22 23.84,43.56 24.93,42.47 25.42,42.47 | 25.42,42.47 25.42,40.96 C6.2 | 41.47,49.81 40.1,51.17 R10.1 39.64,52.9 39.64,53.68 39.42,53.9 31.46,53.9 29.92,55.43 27.43,55.43 | 41.47,49.81 45.2,49.81 45.55,49.45 | J1.GND 46.46,55.08 46.46,53.87 47.42,52.92 49.17,52.92 | G1.- 49.24,50.61 48.09,49.45 45.55,49.45 | v53.66,26.57 53.43,26.33 52.12,26.33 | v45.68,19.42 43.8,21.31 43.8,24.53 43.75,24.58 | IC1.4 41.44,26.85 v41.44,27.02 | 30.75,11.83 32.56,11.83 32.67,11.94 v32.67,13.75 32.67,18.53 v29.12,22.08 28.83,21.79 C2.2 22.72,21.79 22.46,21.52 | U$2.6 27.66,11.72 27.46,11.92 27.46,16.71 27.48,16.73 27.48,19.03 27.03,19.48 23.39,19.48 v22.47,20.39 v22.46,20.41 22.46,21.52 | 20.57,13.19 18.99,14.77 18.99,17.72 v18.8,17.9 | C7.2 31.34,48.69 30.6,47.96 30.6,45.42 28.98,45.42 28.59,45.03 IC2.2 28.71,44.08 v28.71,42.44 | v44.75,47.87 45.55,48.68 45.55,49.45 | v33.21,36.02 33.21,37.12 31.11,39.22 v31.11,40.46 31.01,40.37 28.48,40.37 v26.42,42.42 26.37,42.47 25.42,42.47 | 27.43,55.43 v27.35,55.52 | CN1.1 27.43,55.43
  pour Bottom: 33.2,59.86 arc-90 59.44,32.96 arc-90 33.6,5.95 arc-90 7.86,33.36 arc-90 33.14,59.89
  pour Top: 34.1,59.96 arc90 7.86,33.06 arc90 33.7,6.05 arc90 59.44,33.46 arc90 34.16,59.99
MISO  (via drill 0.4)
  Top 0.254: v27.5,26.58 27.5,28.46 U$1.11
  Bottom 0.254: 36,16.83 U$2.1 34.57,16.8 33.88,17.48 33.88,19.66 27.5,26.05 v27.5,26.58
MOSI  (via drill 0.4)
  Top 0.254: 27.37,29.33 U$1.10 25.37,29.36 24.92,28.91 24.92,23.36 24.42,22.86 24.42,14.65 24.7,14.37 24.7,13.44 25.56,12.58 v28.5,12.58
  Bottom 0.254: v28.5,12.58 29,12.58 30.62,14.21 U$2.4
N$1
  Top 0.254: D1.2 31,59.83 31,60.68 31.64,61.33 43.37,61.33 49.55,55.15 49.55,52.96 46.55,49.96 45.72,49.96 D2.4 | D2.4 44.75,51.08 | D2.4
N$2  (via drill 0.4)
  Top 0.254: v44,61.83 51.87,53.96 51.87,42.58 D3.4 | D3.4 | D2.2 44.37,57.08 44.38,57.07 D2.2 | v41.37,60.46 41.37,58.37 42.67,57.07 D2.2
  Bottom 0.254: v41.37,60.46 42.06,61.15 43.31,61.15 v44,61.83
N$3
  Top 0.254: D4.4 54,31.71 54,32.96 52.75,34.21 52.75,41.83 54.75,43.83 54.75,47.83 D3.2 | D3.2
N$4  (via drill 0.4)
  Top 0.254: v51.75,22.58 50.37,21.21 D5.4 | v58.5,33.58 58.5,34.21 59.12,34.83 D4.2
  Bottom 0.254: v51.75,22.58 51.75,23.33 58.5,30.08 v58.5,33.58
N$5  (via drill 0.4)
  Top 0.254: D6.4 42,13.96 47.48,13.96 48.52,14.99 48.52,17.15 48.86,17.49 51.73,17.49 52.47,18.23 52.47,19.8 53,20.33 v53.87,20.33 | 56.37,21.33 D5.2 56.49,21.26 56.49,20.42 56.38,20.32 55.63,20.32 v55.62,20.33
  Bottom 0.254: v53.87,20.33 v55.62,20.33
N$6  (via drill 0.4)
  Top 0.254: v45.75,10.33 46.37,10.96 47.25,10.96 D6.2 | v34.63,10.13 32.57,10.13 31,11.71 D7.4
  Bottom 0.254: v45.75,10.33 44.76,9.35 39.64,9.35 38.79,10.19 34.68,10.19 v34.63,10.13
N$7  (via drill 0.4)
  Top 0.254: 20.5,15.32 20.5,13.46 v22,11.96 | 20.5,15.32 20.5,15.46 D8.4 20.48,15.34 20.5,15.32 | v33.12,7.96 33.12,7.71 34.12,6.71 D7.2
  Bottom 0.254: v22,11.96 22,11.71 25.75,7.96 v33.12,7.96
N$8  (via drill 0.4)
  Top 0.254: 13.25,23.83 13.25,23.64 13.25,18.46 v19.12,12.58 | v19.12,10.21 19.87,10.21 20.62,9.46 | 13.25,23.83 D9.4 13.25,23.91 13.25,23.83 | 20.62,9.46 D8.2 20.64,9.44 20.62,9.46
  Bottom 0.254: v19.12,10.21 v19.12,12.58
N$9  (via drill 0.4)
  Top 0.254: 11.25,34.83 D10.4 11.26,34.75 13.04,34.75 14.89,32.9 14.89,27.12 14.39,26.62 11.75,26.62 v11.73,26.6 | 10.09,18.74 10.25,18.58 D9.2 10.2,18.74 10.09,18.74 | 10.09,18.74 9.35,19.48 v9.35,19.97
  Bottom 0.254: v11.73,26.6 10.77,25.65 10.77,21.02 9.72,19.97 v9.35,19.97
N$10  (via drill 0.4)
  Top 0.254: v7.75,32.21 7.25,31.71 6.12,31.71 D10.2 | 14.75,45.33 v13.87,44.46 | 14.75,45.33 D11.4 14.8,45.33 14.75,45.33
  Bottom 0.254: v13.87,44.46 12.87,43.45 11.56,43.45 7.75,39.64 v7.75,32.21
N$11
  Top 0.254: D11.2 8.87,45.21 12.13,45.21 12.13,46.74 12.43,47.04 13.12,47.04 20.03,53.95 22.26,53.95 22.83,53.39 22.85,53.39 23.25,52.99 23.25,52.75 | 23.25,52.75 23.25,52.58 D12.4 23.25,52.75 | D11.2
N$12
  Top 0.254: 22.52,31.71 C3.2 22.57,31.55 23.31,31.55 24.22,32.46 27.37,32.46 U$1.6
N$13
  Top 0.254: U$1.17 33.25,26.71 33.25,25.83 34.62,24.46 34.62,23.58 Q1.1
N$14
  Top 0.254: U$1.16 32.37,26.71 32.37,24.21 31.75,23.58 Q1.3
N$15
  Bottom 0.254: IC1.1 47.62,24.46 47.62,22.08 47.87,21.83 Y1.2
N$16
  Bottom 0.254: IC1.2 46.25,24.46 46.25,22.71 45.37,21.83 Y1.1
N$17  (via drill 0.4)
  Top 0.254: v48.97,32.45 45.14,28.62 v45.14,26.86
  Bottom 0.254: v45.14,26.86 45.14,24.61 IC1.3 | v48.97,32.45 48.97,36.18 49.12,36.33 G1.+
N$19  (via drill 0.4)
  Top 0.254: v30.87,49.71 30.64,49.48 v30.64,44.52
  Bottom 0.254: 29.62,44.21 IC2.1 29.58,44.16 29.58,43.25 29.79,43.03 30.64,43.03 v30.64,44.52 | 40,49.08 R4.2 40.01,50.21 39.35,50.87 37.46,50.87 35.99,52.34 30.53,52.34 30.21,52.02 C.C 30.25,51 30.25,49.95 30.49,49.71 v30.87,49.71
N$20  (via drill 0.4)
  Top 0.254: v29.62,48.71 29.62,49.58 32.03,51.99 35.73,51.99 36.33,52.58 v36.87,52.58
  Bottom 0.254: v29.62,48.71 29.62,46.83 IC2.5 | v36.87,52.58 38,52.58 38.12,52.46 R10.2
N$21  (via drill 0.4)
  Top 0.254: v14.87,46.71 15.25,47.08 15.25,47.69 15.59,48.03 | v19.12,50.96 17.35,49.19 16.74,49.19 15.59,48.03 | 15.59,48.03
  Bottom 0.254: v19.12,50.96 22.08,50.96 P.A | R6.2 20.5,23.46 20.5,30.56 20.23,30.83 10.57,30.83 8.44,32.96 8.44,38.94 12.02,42.52 13.82,42.52 14.87,43.57 v14.87,46.71
N$22
  Bottom 0.254: 28,51.12 C.A 27.25,51.05 27.11,51.19 27.11,53.77 27.09,53.8 | R11.1 27.25,53.96 27.09,53.8 | 27.03,53.74 27.09,53.8
N$23
  Bottom 0.254: S.A 35.62,50.96 35.62,50.26 36.87,49.01 R4.1 38,49.08
N$24
  Bottom 0.254: C7.1 32.12,46.96 | 27.75,44.21 IC2.3 | 24.37,58.71 CN1.2
  Bottom 0.406: 32.12,46.96 31.73,46.57 31.73,42.65 31.23,42.14 29.64,42.14 29.07,41.58 28.35,41.58 27.85,42.08 27.85,42.5 27.64,42.71 IC2.3 27.51,44.33 26.8,44.33 26.53,44.6 26.53,51.97 24.96,53.54 24.96,57.13 24.37,57.72 24.37,58.71
N$25
  Bottom 0.254: 46.62,58.33 46.62,58.08 J1.D+ 46.94,58.79 46.94,59.54 46.79,59.69 45.9,59.69 45.38,60.21 42.25,60.21 38,55.96 R3.1
N$26
  Bottom 0.254: C6.1 23.75,40.96 23.75,42.33 21.87,44.21 U1.4
N$27  (via drill 0.4)
  Top 0.254: 37.56,50.64 37.56,48.08 31.6,42.13 29.51,42.13 29.04,41.65 27.45,41.65 27.43,41.63 25.83,41.63 25.56,41.36 25.56,38.49 25.02,37.96 v23.87,37.96 | 37.56,50.64 | 37.56,50.64 37.56,51.59 39.77,53.81 40.04,53.81 v40.4,54.17
  Bottom 0.254: 45.62,57.83 45.87,58.08 45.87,58.21 46,58.33 J1.D- 44.36,55.46 44.36,54.3 44.23,54.17 v40.4,54.17 | R7.1 16.37,45.46
  Bottom 0.406: R7.1 17.61,45.35 18.45,44.5 18.45,39.99 19.64,38.8 23.03,38.8 v23.87,37.96
N$28  (via drill 0.4)
  Top 0.406: v23,47.83 v24.25,46.58
  Bottom 0.254: 25.5,45.33 C4.1 | 20,46.96 U1.1 19.87,47.33 | 10.87,54.46 U$3.1 | U1.3 21.87,46.96
  Bottom 0.406: U1.1 19.8,46.93 18.92,46.93 18.87,46.98 18.87,49.5 18.81,49.56 | 18.81,49.56 17.66,50.71 14.67,50.71 10.93,54.46 10.87,54.46 | U1.3 21.77,48.21 | 21.77,48.21 21.77,48.79 21,49.56 18.81,49.56 | 21.77,48.21 22.15,47.83 v23,47.83 | C4.1 25.5,45.74 24.65,46.58 v24.25,46.58
N$29  (via drill 0.4)
  Top 0.254: v40.12,24.96 39,24.96 37.25,26.71 U$1.22
  Bottom 0.254: v40.12,24.96 41.37,23.71 RX.C
N$30
  Bottom 0.254: RX.A 39.37,23.71 39.37,24.58 35.75,28.21 35.75,39.46 35.87,39.58 35.87,43.21 34.87,44.21 R5.2
N$32
  Bottom 0.254: 41.37,19.96 TX.A | R8.2 32.87,40.46 34.62,38.71 34.62,26.58 39.72,21.48 40.95,21.48 41.46,20.96 41.46,19.92 TX.A | 41.29,19.91 TX.A
N$40  (via drill 0.4)
  Top 0.254: U$1.8 27.5,30.96 28.79,30.96 28.87,30.87 v28.87,30.33
  Bottom 0.254: v28.87,30.33 28.87,27.21 36.12,19.96 39.37,19.96 TX.C
RST  (via drill 0.4)
  Top 0.254: U$1.13 29.87,26.71 29.87,25.9 27.61,23.64 27.61,21.87 24.93,19.19 24.93,14.86 v25.82,13.96 26.22,13.57 28.52,13.57 28.67,13.72 28.67,15.45 R9.2
  Bottom 0.254: U$2.5 36,11.71 33.87,11.71 32.75,10.58 25.63,10.58 S1.4 25.38,11.31 25.38,13.52 v25.82,13.96
SCK  (via drill 0.4)
  Top 0.254: 27.37,30.08 U$1.9 27.31,30.23 v25.6,30.23
  Bottom 0.254: 36,14.33 U$2.3 34.14,14.26 33.38,15.03 33.38,19.45 25.6,27.23 v25.6,30.23
SCL  (via drill 0.4)
  Top 0.254: v33.75,28.46 33.87,28.33 33.87,26.83 U$1.18 | v36.58,35.75 33.78,32.96 v33.75,32.96 | v32.25,6.96 32.25,8.58 30.1,10.73 30.1,13.18 31.44,14.52 31.44,18.28 31.98,18.82 33.75,18.82 34.4,19.48 34.4,20.36 v35.62,21.58
  Bottom 0.254: v33.75,32.96 v33.75,28.46 33.75,26.71 35.62,24.83 v35.62,21.58 | 39.75,40.46 R2.1 39.77,37.61 39.4,37.24 37.65,37.24 36.58,36.17 v36.58,35.75 36.58,35.57 38.66,33.48 43.11,33.48 43.75,32.84 43.75,29.71 IC1.5 | 28.37,3.08 TP9.P$1
  Bottom 0.406: TP9.P$1 29.58,3.04 32.25,5.7 v32.25,6.96
SDA  (via drill 0.4)
  Top 0.254: v37.48,28.46 v37.47,28.46 37.3,28.46 37.26,28.5 35.79,28.5 34.87,27.58 34.87,26.83 U$1.19 | 43.87,7.96 43.94,7.96 | 36.37,2.96 TP8.P$1
  Top 0.406: TP8.P$1 37.41,4.01 39.21,4.01 43.16,7.96 43.94,7.96 46.68,7.96 48.78,10.05 48.78,10.61 v49.25,11.08
  Bottom 0.254: 45,28.83 45,29.58 IC1.6 | R1.1 39.75,44.08 39.75,42.71 45,37.46 45,29.71 IC1.6 | IC1.6 45.11,29.08 | 45.11,29.08 45.12,28.96 | 37.75,28.18 v37.48,28.46 37.48,28.37 37.94,27.91 45.19,27.91 45.24,27.96 | 45.11,28.71 45.11,29.08 | v49.25,11.08 49.25,27.13 48.89,27.48 45.72,27.48 45.24,27.96 | IC1.6 45.07,28.14 45.24,27.96
V_USB  (via drill 0.4)
  Top 0.254: U$1.7 27.37,31.71 | 27.5,35.83 U$1.2 27.37,35.83
  Top 0.406: 27.37,31.71 24.89,31.71 24.25,31.06 v24.25,29.58 | U$1.7 29.03,31.76 29.49,32.22 29.49,35.08 28.81,35.76 U$1.2 25.94,35.76 v25.87,35.83 25.87,37.98 26.41,38.52 26.41,41.04 29.25,41.04 29.75,41.54 31.84,41.54 38.14,47.84 38.14,51.35 39.89,53.1 40.54,53.1 41.26,53.82 41.26,54.86 v41.47,55.06
  Bottom 0.254: 27.75,23.58 C2.1 | 24.25,24.33 D13.A 24.25,24.46 | 45.37,58.58 J1.VBUS
  Bottom 0.406: J1.VBUS 44.26,56.57 43.72,56.03 42.25,56.03 41.47,55.24 v41.47,55.06 | D13.A 24.19,29.53 v24.25,29.58 | C2.1 27.03,23.49 26.19,24.33 24.25,24.33
VCC  (via drill 0.4)
  Top 0.254: 44.5,10.21 44.5,9.46 D6.1 44.42,9.38 44.41,9.37 44.37,9.33 | 54.75,18.46 D5.1 54.75,18.58 | 59.12,31.71 D4.1 59.12,31.58 | 56.5,45.08 D3.1 | 47.25,55.58 D2.1 | D1.1 34.25,59.71 | 20.75,56.96 D12.1 | 10.37,47.96 D11.1 | D12.1 21,56.58 | 6,34.96 6,34.9 D10.1 6.12,34.96 | 3.37,37.96 TP15.P$1 | 8.75,21.46 D9.1 | 30.87,6.71 D7.1 31,6.58 | 18,11.08 D8.1 | 8.87,21.33 D9.1 | 18,11.21 D8.1 | 10.25,47.83 D11.1 | D9.1 | D8.1 | D3.1 | D2.1 | D2.1 47.2,55.42 | D12.1 | D11.1
  Top 0.406: D2.1 47.2,55.42 42.99,55.42 38.7,59.71 34.25,59.71 | D3.1 56.39,34.31 v57.37,33.33 59.12,31.58 | 54.75,18.46 54.75,26.65 59.13,31.04 59.13,31.63 D4.1 | D5.1 53.12,16.91 49.1,16.91 49.1,14.75 47.39,13.04 44.25,13.04 38.5,7.29 38.5,5.07 | 38.5,5.07 32.59,5.07 D7.1 29.51,8.14 29.51,11.02 | 8.87,21.33 9.63,21.33 12.28,18.68 12.28,16.66 D8.1 18.73,11.04 18.76,11.07 29.47,11.07 29.51,11.02 | D9.1 8.76,33.45 7.31,34.9 6,34.9 | D10.1 3.99,34.85 3.25,35.59 3.37,35.72 3.37,37.96 | v10.25,46.08 10.16,46.17 9.39,46.17 9.39,46.96 D11.1 12.09,47.93 v16.5,52.33 17.73,53.57 18.82,53.57 19.79,54.54 20.84,54.54 20.84,56.43 21,56.58 | v27.62,49.71 26.06,51.27 26.06,52.75 | 26.06,52.75 26.06,53.57 22.56,57.07 D12.1 | 26.06,52.75 28.71,52.75 v28.87,52.58 v28.88,52.57 35.49,52.57 35.57,52.65 35.57,55.73 34.26,57.03 34.26,59.75 D1.1 | 38.5,5.07 39.33,5.07 42.88,8.62 43.66,8.62 44.42,9.38 | 29.51,11.02 29.51,13.42 30.85,14.76 30.85,18.05 30.52,18.38 28.75,18.38 v28.47,18.1
  Bottom 0.254: 47.62,29.58 IC1.8 | 27.62,46.83 IC2.4 | 29.12,53.96 R11.2 | U$3.2 12.75,56.08 | D13.C 24.25,20.58 | 30.62,16.71 U$2.2 | 3.37,38.08 TP15.P$1
  Bottom 0.406: IC1.8 47.61,31.42 47.73,31.54 49.45,31.54 50.25,30.74 50.25,28.68 50.87,28.06 C1.1 55.65,28.06 57.37,29.78 v57.37,33.33 | U$2.2 28.53,16.8 28.47,16.86 v28.47,18.1 28.47,20.06 28.51,20.1 28.03,20.58 24.25,20.58 | v10.25,46.08 10.25,43.74 4.52,38.02 TP15.P$1 | 12.75,56.08 v16.5,52.33 | IC2.4 27.64,49.69 v27.62,49.71 | R11.2 29.14,52.85 v28.87,52.58

### Text on the board
tNames: 12 | 1 | A0 | 11 | 2 | VCC | 10 | A1 | VCC | A2 | 9 | 3 | GND | 8 | A3 | 4 | D7 | 5 | A4 | 7 | 6 | D0 | D6 | D1 | D4 | SDA | D5 | SCL